# EAGLE design FluxamasynthPi (EAGLE 9.0.0)
ABBREV: Flux3; AUTHOR: Nadya B.; PROJECT: Fluxamasynth 3
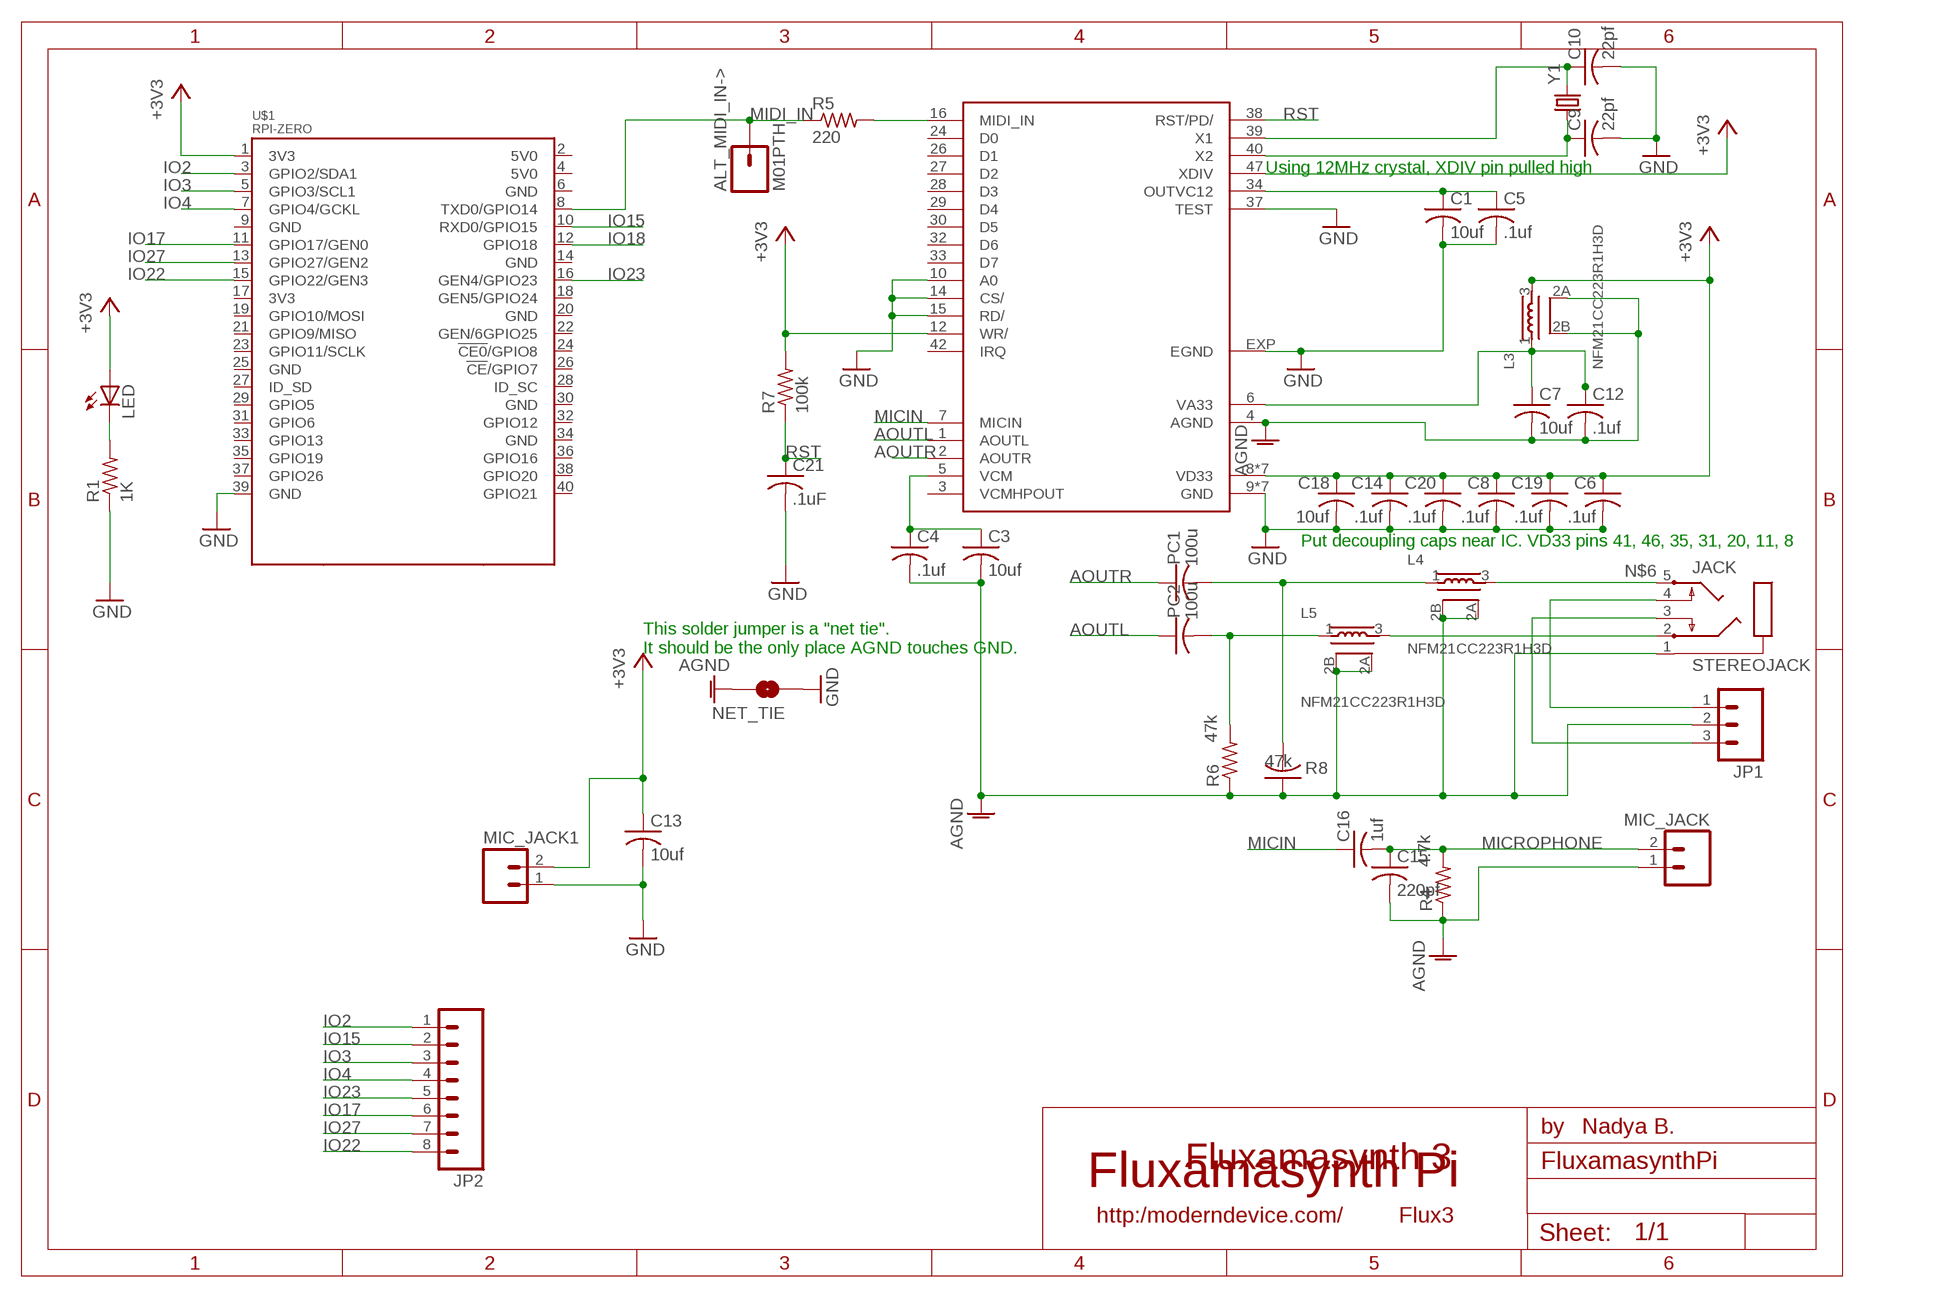
[diagram p0: schematic, sheet 1]

## Parts
ALT_MIDI_IN->  M01PTH  [1X01]
C1  10uf  C-USC0805K  [C0805K]
C3  10uf  C-USC0805K  [C0805K]
C4  .1uf  C-USC0603K  [C0603K]
C5  .1uf  C-USC0603K  [C0603K]
C6  .1uf  C-USC0603K  [C0603K]
C7  10uf  C-USC0805K  [C0805K]
C8  .1uf  C-USC0603K  [C0603K]
C9  22pf  C-USC0603  [C0603]
C10  22pf  C-USC0603  [C0603]
C12  .1uf  C-USC0603K  [C0603K]
C13  10uf  C-USC0805K  [C0805K]
C14  .1uf  C-USC0603K  [C0603K]
C15  220pf  C-USC0805K  [C0805K]
C16  1uf  C-USC0603K  [C0603K]
C18  10uf  C-USC0603K  [C0603K]
C19  .1uf  C-USC0603K  [C0603K]
C20  .1uf  C-USC0603K  [C0603K]
C21  .1uF  C-USC0603K  [C0603K]
JACK  STEREOJACK  [STX3100]
JP1  M03PTH  [1X03]
JP2  M08  [1X08]
L3  NFM21CC223R1H3D  [3PC]
L4  NFM21CC223R1H3D  [3PC]
L5  NFM21CC223R1H3D  [3PC]
LED  LED0603  [LED-0603]
MIC_JACK  M02PTH  [1X02]
MIC_JACK1  M02PTH  [1X02]
NET_TIE  MODERNDEVICE_SOLDERJUMPERTRACE  [MODERNDEVICE_SJ_2S-TRACE]
PC1  100u  C-USC1206K  [C1206K]
PC2  100u  C-USC1206K  [C1206K]
R1  1K  R-US_R0603  [R0603]
R4  4.7k  R-US_R0603  [R0603]
R5  220  R-US_R0603  [R0603]
R6  47k  R-US_R0603  [R0603]
R7  100k  R-US_R0603  [R0603]
R8  47k  C-USC0603K  [C0603K]
SAM2695  SAM2695  [QFN48]
U$1  RPI-ZERO  [RASPBERRYPI_BASTELSTUBE_V13_RASPI_BOARD_B+_FULL]
Y1  CRYSTALTXC-7A  [CRYSTAL-TXC-7A]

## Nets
+3V3 [VCC]: C6.1 C8.1 C13.1 C14.1 C18.1 C19.1 C20.1 L3.3 LED.A MIC_JACK1.2 R7.2 SAM2695.8(VD33) SAM2695.11(VD33) SAM2695.12(WR/) SAM2695.20(VD33) SAM2695.31(VD33) SAM2695.35(VD33) SAM2695.41(VD33) SAM2695.46(VD33) SAM2695.47(XDIV) U$1.1(3V3)
AGND [GND]: C3.2 C4.2 C7.2 C12.2 C15.2 JACK.1 JP1.2 L3.2A L3.2B L4.2A L4.2B L5.2A L5.2B MIC_JACK.1 NET_TIE.2 R4.1 R6.1 R8.1 SAM2695.4(AGND)
AOUTL: PC2.1 SAM2695.1(AOUTL)
AOUTR: PC1.1 SAM2695.2(AOUTR)
GND [GND]: C1.2 C5.2 C6.2 C8.2 C9.2 C10.2 C13.2 C14.2 C18.2 C19.2 C20.2 C21.2 MIC_JACK1.1 NET_TIE.1 R1.1 SAM2695.9(GND) SAM2695.10(A0) SAM2695.13(GND) SAM2695.14(CS/) SAM2695.15(RD/) SAM2695.18(GND) SAM2695.25(GND) SAM2695.36(GND) SAM2695.37(TEST) SAM2695.45(GND) SAM2695.48(GND) SAM2695.EXP(EGND) U$1.39(GND)
IO2: JP2.1 U$1.3(GPIO2/SDA1)
IO3: JP2.3 U$1.5(GPIO3/SCL1)
IO4: JP2.4 U$1.7(GPIO4/GCKL)
IO15: JP2.2 U$1.10(RXD0/GPIO15)
IO17: JP2.6 U$1.11(GPIO17/GEN0)
IO18: U$1.12(GPIO18)
IO22: JP2.8 U$1.15(GPIO22/GEN3)
IO23: JP2.5 U$1.16(GEN4/GPIO23)
IO27: JP2.7 U$1.13(GPIO27/GEN2)
MICIN: C16.1 SAM2695.7(MICIN)
MICROPHONE: C15.1 C16.2 MIC_JACK.2 R4.2
MIDI_IN: ALT_MIDI_IN->.1 R5.1 U$1.8(TXD0/GPIO14)
N$5: L5.1 PC2.2 R6.2
N$6: JACK.5 L4.3
N$9: LED.C R1.2
N$12: R5.2 SAM2695.16(MIDI_IN)
N$21: JACK.4 JP1.1
N$24: JACK.3 JP1.3
OUT_L: JACK.2 L5.3
OUT_R: L4.1 PC1.2 R8.2
OUTVC12: C1.1 C5.1 SAM2695.34(OUTVC12)
RST: C21.1 R7.1 SAM2695.38(RST/PD/)
VA33 [VCC]: C7.1 C12.1 L3.1 SAM2695.6(VA33)
VCM: C3.1 C4.1 SAM2695.5(VCM)
XTL1: C10.1 SAM2695.39(X1) Y1.P$2
XTL2: C9.1 SAM2695.40(X2) Y1.P$1
Unconnected: SAM2695.3(VCMHPOUT) SAM2695.24(D0) SAM2695.26(D1) SAM2695.27(D2) SAM2695.28(D3) SAM2695.29(D4) SAM2695.30(D5) SAM2695.32(D6) SAM2695.33(D7) SAM2695.42(IRQ) U$1.2(5V0) U$1.4(5V0) U$1.6(GND) U$1.9(GND) U$1.14(GND) U$1.17(3V3) U$1.18(GEN5/GPIO24) U$1.19(GPIO10/MOSI) U$1.20(GND) U$1.21(GPIO9/MISO) U$1.22(GEN/6GPIO25) U$1.23(GPIO11/SCLK) U$1.24(!CE0!/GPIO8) U$1.25(GND) U$1.26(!CE!/GPIO7) U$1.27(ID_SD) U$1.28(ID_SC) U$1.29(GPIO5) U$1.30(GND) U$1.31(GPIO6) U$1.32(GPIO12) U$1.33(GPIO13) U$1.34(GND) U$1.35(GPIO19) U$1.36(GPIO16) U$1.37(GPIO26) U$1.38(GPIO20) U$1.40(GPIO21)

## Notes on the sheet
- Using 12MHz crystal, XDIV pin pulled high
- Put decoupling caps near IC. VD33 pins 41, 46, 35, 31, 20, 11, 8
- This solder jumper is a "net tie".
  It should be the only place AGND touches GND.
- Fluxamasynth Pi

## Library data of the parts
ALT_MIDI_IN-> = ModernDevice:M01: Header 1 Standard 1-pin 0.1" header. Use with straight break away headers (SKU : PRT-00116), right angle break away headers (PRT-00553), swiss pins (PRT-00743), machine pins (PRT-00117), and female headers (PRT-00115).
C1 C3-C10 C12-C16 C18-C21 PC1 PC2 R8 = ModernDevice:C-US: CAPACITOR, American symbol
JACK = ModernDevice:STEREOJACK: MIC/HEADPHONE JACK Stereo jack with two switches. Kycon STX3100, CUI SJ1-3555NG and/or 4UCon 05544
JP1 = ModernDevice:M03: Header 3 Standard 3-pin 0.1" header. Use with straight break away headers (SKU : PRT-00116), right angle break away headers (PRT-00553), swiss pins (PRT-00743), machine pins (PRT-00117), and female headers (PRT-00115). Molex polarized connector foot print use with SKU : PRT-08232 with associated crimp pins and housings.
JP2 = ModernDevice:M08: Header 8 Standard 8-pin 0.1" header. Use with straight break away headers (SKU : PRT-00116), right angle break away headers (PRT-00553), swiss pins (PRT-00743), machine pins (PRT-00117), and female headers (PRT-00115).
L3-L5 = ModernDevice:NFM21CC223R1H3D: CAPACITOR-TYPE NOISE SUPPRESSION FILTER digikey #NFM21CC223R1H3D
LED = ModernDevice:LED: LEDs Standard schematic elements and footprints for 5mm, 3mm, 1206, and 0603 sized LEDs. 5mm - Spark Fun Electronics SKU : COM-00529 (and others)
MIC_JACK MIC_JACK1 = ModernDevice:M02: Header 2 Standard 2-pin 0.1" header. Use with straight break away headers (SKU : PRT-00116), right angle break away headers (PRT-00553), swiss pins (PRT-00743), machine pins (PRT-00117), and female headers (PRT-00115). Molex polarized connector foot print use with SKU : PRT-08233 with associated crimp pins and housings.
NET_TIE = BBLeo_v2:MODERNDEVICE_SOLDERJUMPER: Solder Jumper Standard SMD solder jumper. Used to automate production. Two varients : Normally Open and Normally Closed are the same, but have different paste layers. NC will have a large amount of paste and should jumper during reflow.
R1 R4-R7 = ModernDevice:R-US_: RESISTOR, American symbol
SAM2695 = ModernDevice:SAM2695
U$1 = RPI-Zero:RPI-ZERO
Y1 = SparkFun-FreqCtrl:CRYSTAL: Various standard crystals. Proven footprints. Spark Fun Electronics SKU : COM-00534

## Net classes
0 default: width 0.152 mm, drill 0.152 mm, clearance 0.152 mm
1 GND: width 0.152 mm, drill 0.152 mm, clearance 0.152 mm
2 VCC: width 0.152 mm, drill 0.152 mm, clearance 0.152 mm
3 VBUS: width 0.152 mm, drill 0.152 mm, clearance 0.152 mm

## Board
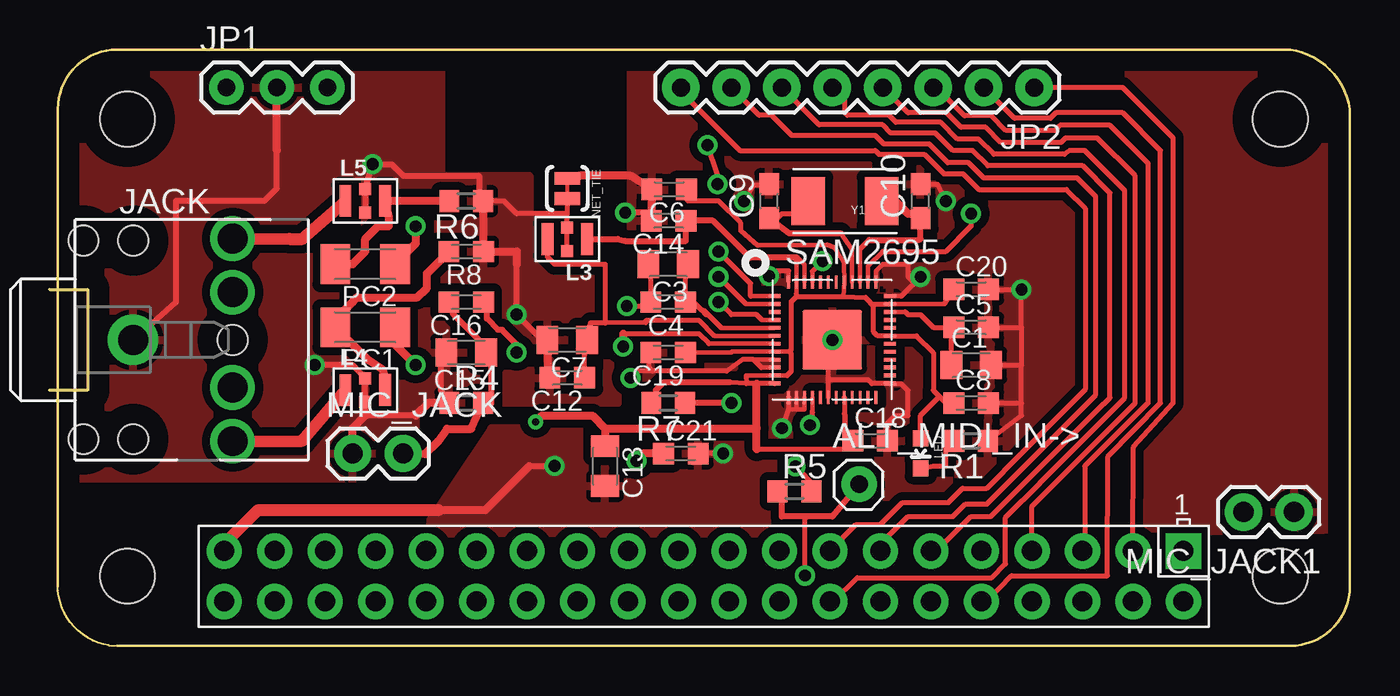
[diagram p1: board, top side]
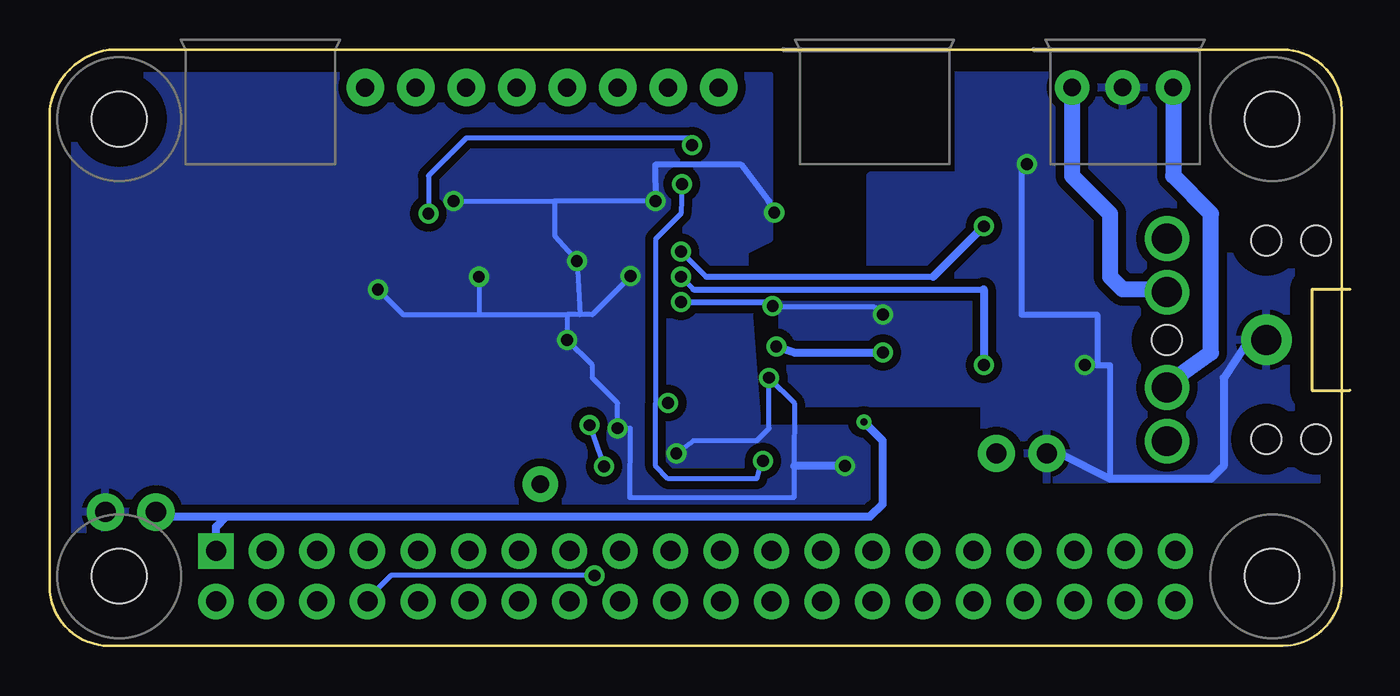
[diagram p2: board, bottom side, seen from below]

Size 65.41 x 30.01 mm. Coordinates in mm from the lower left corner, seen from the top.
Outline: 2.99,0.03 arc-81 0.4,3.08
Outline: 2.97,0.03 3.4,0
Outline: 0,17.94 1.91,17.94 1.91,12.86 0,12.86
Copper layers (1*16): Top 0.035mm / dielectric 1.5mm / Bottom 0.035mm
Design rules "default *": minimum track width 6mil, minimum drill 0.35mm, track to track 6mil, track to pad 6mil, pad to pad 6mil, via to via 6mil, smd to smd 6mil, copper to edge 40mil, drill to drill 6mil, minimum pad ring 10mil, minimum via ring 8mil, stop-mask expansion 4mil, vias tented up to drill 25mil, thermal gap 10mil

### Footprints (pad centres in the part's own frame; a part is rotated, then mirrored left to right if it is on the bottom)
1X01 = drill 0.889 pad 1.778: 1 0,0
C0805K = smd 1.1 x 1.4: 1 -1,0; 2 1,0
C0603K = smd 1.05 x 1.08: 1 -0.875,0; 2 0.875,0
C0603 = smd 1.1 x 1: 1 -0.85,0; 2 0.85,0
STX3100 = drill 1.5 pad 2.54: 1 2.929,0.002 | drill 1.5: 2 7.929,5.102; 3 7.929,2.402; 4 7.929,-2.398; 5 7.929,-5.098 | hole 1.5: 2.929,5.002; 2.929,-4.998; 7.929,0.002; 0.429,5.002; 0.429,-4.998
1X03 = drill 0.889 pad 1.727: 1 0,0; 2 2.54,0; 3 5.08,0
1X08 = drill 0.9 pad 1.88: 1 0,0; 2 2.54,0; 3 5.08,0; 4 7.62,0; 5 10.16,0; 6 12.7,0; 7 15.24,0; 8 17.78,0
3PC = smd 0.6 x 1.6: 1 0.998,0.013; 3 -1,0.01 | smd 0.6 x 0.6: 2A 0,-0.58; 2B 0,0.6
LED-0603 = smd 0.8 x 0.8: A 0,-0.75; C 0,0.75
1X02 = drill 1.016 pad 1.88: 1 0,0; 2 2.54,0
MODERNDEVICE_SJ_2S-TRACE = smd 0.635 x 1.27: 1 -0.508,0; 2 0.508,0
C1206K = smd 1.5 x 2: 1 -1.5,0; 2 1.5,0
R0603 = smd 1 x 1.1: 1 -0.85,0; 2 0.85,0
QFN48 = smd 0.65 x 0.2: 1 -2.9,2.206; 2 -2.9,1.806; 3 -2.9,1.406; 4 -2.9,1.006; 5 -2.9,0.606; 6 -2.9,0.206; 7 -2.9,-0.194; 8 -2.9,-0.594; 9 -2.9,-0.994; 10 -2.9,-1.394; 11 -2.9,-1.794; 12 -2.9,-2.194; 25 2.9,-2.194; 26 2.9,-1.794; 27 2.9,-1.394; 28 2.9,-0.994; 29 2.9,-0.594; 30 2.9,-0.194; 31 2.9,0.206; 32 2.9,0.606; 33 2.9,1.006; 34 2.9,1.406; 35 2.9,1.806; 36 2.9,2.206 | smd 0.2 x 0.65: 13 -2.2,-2.894; 14 -1.8,-2.894; 15 -1.4,-2.894; 16 -1,-2.894; 17 -0.6,-2.894; 18 -0.2,-2.894; 19 0.2,-2.894; 20 0.6,-2.894; 21 1,-2.894; 22 1.4,-2.894; 23 1.8,-2.894; 24 2.2,-2.894; 37 2.2,2.906; 38 1.8,2.906; 39 1.4,2.906; 40 1,2.906; 41 0.6,2.906; 42 0.2,2.906; 43 -0.2,2.906; 44 -0.6,2.906; 45 -1,2.906; 46 -1.4,2.906; 47 -1.8,2.906; 48 -2.2,2.906 | smd 3 x 3: EXP 0,0
RASPBERRYPI_BASTELSTUBE_V13_RASPI_BOARD_B+_FULL = drill 1 pad 1.778 square: 1 8.37,25.23 | drill 1 pad 1.778: 2 8.37,27.77; 3 10.91,25.23; 4 10.91,27.77; 5 13.45,25.23; 6 13.45,27.77; 7 15.99,25.23; 8 15.99,27.77; 9 18.53,25.23; 10 18.53,27.77; 11 21.07,25.23; 12 21.07,27.77; 13 23.61,25.23; 14 23.61,27.77; 15 26.15,25.23; 16 26.15,27.77; 17 28.69,25.23; 18 28.69,27.77; 19 31.23,25.23; 20 31.23,27.77; 21 33.77,25.23; 22 33.77,27.77; 23 36.31,25.23; 24 36.31,27.77; 25 38.85,25.23; 26 38.85,27.77; 27 41.39,25.23; 28 41.39,27.77; 29 43.93,25.23; 30 43.93,27.77; 31 46.47,25.23; 32 46.47,27.77; 33 49.01,25.23; 34 49.01,27.77; 35 51.55,25.23; 36 51.55,27.77; 37 54.09,25.23; 38 54.09,27.77; 39 56.63,25.23; 40 56.63,27.77 | hole 2.75: 3.5,3.5; 3.5,26.5; 61.5,3.5; 61.5,26.5
CRYSTAL-TXC-7A = smd 1.7 x 2.4: P$1 1.85,0; P$2 -1.85,0

### Placement (x,y rotation side)
ALT_MIDI_IN->  40.72,8.14 0 top
C1  46.36,14.13 0 top
C3  31.11,19.21 180 top
C4  31.11,17.31 180 top
C5  46.36,16.04 0 top
C6  31.17,22.97 180 top
C7  26.04,15.4 180 top
C8  46.36,12.23 0 top
C9  36.2,22.39 90 top
C10  43.82,22.39 90 top
C12  26.04,13.5 180 top
C13  27.94,9.05 270 top
C14  31.14,21.4 180 top
C15  20.95,14.77 180 top
C16  20.95,17.31 180 top
C18  41.28,10.32 0 top
C19  31.11,14.77 180 top
C20  46.36,17.94 0 top
C21  31.75,9.69 0 top
JACK  1.27,15.4 0 top
JP1  8.89,28.1 0 top
JP2  49.53,28.1 180 top
L3  26.04,20.48 180 top
L4  15.88,12.86 0 top
L5  15.88,22.39 0 top
LED  43.82,9.69 180 top
MIC_JACK  15.24,9.69 0 top
MIC_JACK1  62.6,6.74 180 top
NET_TIE  26.04,23.02 270 top
PC1  15.88,16.04 180 top
PC2  15.88,19.21 180 top
R1  46.36,10.32 180 top
R4  20.95,12.23 0 top
R5  37.47,7.78 0 top
R6  20.95,22.39 180 top
R7  31.11,12.23 180 top
R8  20.95,19.85 180 top
SAM2695  39.37,15.4 0 top
U$1  65.41,30.01 180 top
Y1  40.01,22.39 180 top

### Tracks (layer width: path | path; a pad name or v marks a point on that pad's centre or on a via)
+3V3  (via drill 0.35)
  Top 0.229: SAM2695.35 44.99,17.21 | 37.57,17.72 SAM2695.47 37.57,19.44 | 39.93,17.59 SAM2695.41 39.95,19.21 39.95,19.27 39.6,19.87 | 35.04,13.61 SAM2695.11 37.09,13.61 | C19.1 34.29,14.77 34.33,14.81 SAM2695.8 37.11,14.81 37.12,14.82 37.21,14.82 | SAM2695.46 37.97,19.19 37.62,19.54
  Top 0.254: 44.99,17.21 45.09,17.31 C20.1 | 44.77,12.55 44.45,12.86 44.45,14.77 43.61,15.61 SAM2695.31 41.65,15.61 41.45,15.81 41.45,17.11 41.35,17.21 | 44.77,12.55 45.09,12.23 C8.1 | 41.35,17.21 41.28,17.28 41.28,17.31 41.05,17.54 39.93,17.59 37.57,17.59 | 41.35,17.21 SAM2695.35 | 37.57,17.72 37.57,17.59 | LED.A 43.82,11.59 44.77,12.55 | C18.1 40.01,10.72 40.01,11.59 39.98,11.7 SAM2695.20 39.97,10.36 40.01,9.89 35.56,9.89 | 35.04,13.61 35.04,13.21 | 35.04,13.21 34.21,13.27 | SAM2695.12 35.56,13.21 35.04,13.21 | 37.09,13.61 37.31,13.83 37.31,14.72 37.21,14.82 37.24,14.82 37.31,14.9 37.31,17.33 37.57,17.59 | 39.6,19.87 39.47,20.05 39.12,20.18 35.61,20.15 34.77,20.89 34.77,21.27 33.66,22.39 32.09,22.39 C6.1 | 37.57,19.44 37.47,19.54
  Top 0.305: 37.62,19.54 37.47,19.54 35.23,19.54 33.38,21.4 C14.1 32,20.38 28.96,20.38 28.57,20.48 27.3,20.48 L3.3 | 34.21,13.27 30.89,13.27 30.48,12.86 30.48,12.44 R7.2
  Top 0.406: 35.56,9.89 35.56,10.96 | 35.56,10.96 35.56,13.21 | 27.94,10.96 35.56,10.96 | v24.45,11.28 24.77,11.59 27.3,11.59 27.94,10.96 | 27.94,10.96 C13.1
  Bottom 0.406: U$1.1 57.04,5.99 56.52,6.51 | 56.52,6.51 24.13,6.51 23.5,7.15 23.5,10.32 v24.45,11.28 | MIC_JACK1.2 59.83,6.51 56.52,6.51
AGND  (via drill 0.6)
  Top 0.229: SAM2695.4 35.82,16.41
  Top 0.254: 35.82,16.41 35.56,16.67 34.29,16.67 v33.66,17.31 | C3.2 30.24,19.09 C4.2 30.04,17.11 v29.03,17.11 | L3.2B L3.2A 26.04,21.75 | NET_TIE.2 26.04,21.75 | 26.04,21.75 23.5,21.75 22.86,22.39 R6.1
  Top 0.305: v13.33,14.13 15.24,14.13 L4.2B L4.2A 15.88,11.59 18.41,11.59 | L5.2A L5.2B v16.26,24.24 17.2,24.24 17.78,23.66 21.59,23.66 21.59,22.6 R6.1 | 23.5,19.21 v23.5,16.67 24.77,15.4 24.77,15.04 C7.2 | JACK.1 6.35,17.31 6.35,22.39 10.79,22.39 11.43,23.02 11.43,24.93 | R4.1 19.68,12.86 19.68,14.13 C15.2
  Top 0.406: C7.2 25.04,13.62 C12.2 | 23.5,19.21 23.5,19.85 R8.1 21.83,22.36 R6.1 | R4.1 19.05,12.23 18.41,11.59 | MIC_JACK.1 15.24,10.96 15.88,11.59 | 11.43,24.93 JP1.2
  Bottom 0.254: 29.21,17.31 29.21,17.28 | v23.5,16.67 23.55,16.67 23.93,17.06 28.98,17.06
  Bottom 0.305: v13.33,14.13 12.7,14.13 | 12.7,14.13 12.06,14.13 12.06,8.42 | 12.7,14.13 12.7,16.67 16.51,16.67 16.51,23.99 v16.26,24.24 | v33.66,17.31 29.21,17.31 | 29.21,17.28 v29.03,17.11 28.98,17.06
  Bottom 0.406: JACK.1 5.08,15.41 6.35,13.5 6.35,9.05 6.98,8.42 12.06,8.42 14.61,9.69 MIC_JACK.1
  pour Top (isolate 0.406): -1.27,8.42 -0.64,31.28 19.68,31.28 19.68,23.66 24.13,23.66 24.13,19.21 28.57,19.21 28.57,12.23 18.41,12.23 18.41,8.42
  pour Bottom (isolate 0.406): -1.27,8.42 -1.9,30.01 19.68,30.01 19.68,23.66 24.13,23.66 24.13,19.21 28.57,19.21 28.57,12.23 18.41,12.23 18.41,8.42
AOUTL  (via drill 0.6)
  Top 0.229: SAM2695.1 35.26,17.61
  Top 0.254: 35.26,17.61 35.26,18.25 v33.66,19.85
  Top 0.406: v18.41,21.12 18.41,20.25 PC2.1
  Bottom 0.254: v33.66,19.85 32.38,18.58
  Bottom 0.305: 32.38,18.58 20.95,18.58
  Bottom 0.406: 20.95,18.58 v18.41,21.12
AOUTR  (via drill 0.6)
  Top 0.229: SAM2695.2 35.02,17.21
  Top 0.254: 35.02,17.21 v33.66,18.58
  Top 0.406: v18.41,14.13 17.14,15.4 17.14,15.81 PC1.1
  Bottom 0.254: v33.66,18.58 33.02,17.94
  Bottom 0.305: 33.02,17.94 18.41,17.94
  Bottom 0.406: 18.41,17.94 v18.41,14.13
GND  (via drill 0.6)
  Top 0.229: SAM2695.36 42.85,17.61 | SAM2695.37 41.57,18.87 41.91,19.21 | 37.16,11.9 37.57,11.9 | 37.57,11.9 37.97,11.9 SAM2695.15 | SAM2695.14 37.57,11.9 | SAM2695.9 35.41,14.41 | SAM2695.10 35.81,14.01 | SAM2695.45 38.37,18.85 | SAM2695.48 37.17,18.87 | SAM2695.13 37.17,11.93
  Top 0.254: C1.2 48.9,14.13 | C20.2 v48.9,17.94 48.9,16.04 | 48.9,16.04 48.9,14.13 | C8.2 48.9,12.23 | 48.9,12.23 48.9,14.13 | 42.85,17.61 43.5,18.26 | 41.91,19.21 43.18,19.21 43.18,18.58 43.5,18.26 | SAM2695.13 37.16,11.9 | 30.33,13.83 34.06,13.83 34.85,14.41 35.41,14.41 35.81,14.01 | 30.33,13.83 30.15,14.03 30.15,14.68 C19.2 | SAM2695.18 39.17,13.5 | 39.17,13.5 39.17,15.2 | 39.17,13.5 39.27,13.4 41.17,13.4 41.36,13.21 SAM2695.25 42.83,13.21 43.18,12.86 43.18,11.59 42.55,11.59 42.15,11.2 C18.2 | 37.17,18.87 36.44,18.87 v36.19,18.62 | 38.37,18.85 v38.89,19.37 | 36.2,23.19 35.4,23.19 v34.93,22.39 | C10.2 44.67,23.24 v45.09,22.39 | 43.5,18.26 v43.82,18.58 | R1.1 48.9,11.59 48.9,12.23 | C5.2 48.9,16.04 | 37.17,11.93 v36.83,10.96 | 30.33,13.83 29.54,13.83 v29.21,13.5 | v33.88,9.69 C21.2
  Top 0.305: C14.2 30.29,21.81 v28.96,21.81 | 24.13,9.05 v25.4,9.05
  Top 0.406: 36.2,23.19 C9.2 | 32.38,9.29 C21.2 | 30.29,21.81 C6.2 29.21,23.66 26.67,23.66 NET_TIE.1 | 19.54,6.84 21.92,6.84 24.13,9.05
  Top 0.61: 19.54,6.84 10.49,6.84 8.89,5.24 8.89,4.89 U$1.39
  Bottom 0.254: v48.9,17.94 47.62,16.67 43.82,16.67 | 43.82,16.67 39.37,16.67 | 39.37,16.67 SAM2695.EXP 38.1,14.13 38.1,13.5 36.83,12.23 v36.83,10.96 36.2,10.96 36.22,7.45 27.96,7.45 27.96,9.06 27.94,12.23 v29.21,13.5 29.21,10.96 29.84,10.32 33.02,10.32 v33.88,9.69 | v36.19,18.62 36.24,18.62 36.2,18.58 38.1,16.67 38.74,16.67 | 38.74,16.67 39.37,16.67 | 38.74,16.67 v38.89,19.37 40.01,20.64 40.01,22.39 | v45.09,22.39 40.01,22.39 | v34.93,22.39 40.01,22.39 | v43.82,18.58 43.82,16.67
  Bottom 0.305: v28.96,21.81 29.21,22.39 30.61,24.22 34.95,24.22 v34.93,22.39
  Bottom 0.406: v25.4,9.05 27.95,9.05 27.96,9.06
  other vias: 39.37,15.4
  pour Bottom (isolate 0.406): 29.21,28.74 29.21,20.48 30.48,19.85 29.84,11.59 29.84,10.96 22.22,10.96 19.05,5.88 66.04,5.88 66.04,28.74
  pour Top (isolate 0.406): 29.21,33.82 29.21,20.48 30.48,19.85 29.84,11.59 29.84,10.96 22.22,10.96 18.41,5.24 66.04,5.88 66.04,33.82
IO2
  Top 0.254: U$1.3 54.52,10.01 56.52,12.23 56.52,25.56 53.98,28.1 JP2.1
IO3
  Top 0.254: 52.07,4.89 52.07,9.05 55.25,12.23 55.25,24.29 53.34,26.2 50.83,26.2 50.57,25.95 48.11,25.95 47.37,26.68 46.03,26.68 44.98,27.72 44.83,27.72 JP2.3
  Top 0.305: 52.07,4.89 U$1.5
IO4
  Top 0.254: U$1.7 49.42,7.03 54.61,12.23 54.61,23.66 52.71,25.56 51.11,25.56 50.88,25.34 47.85,25.34 47.09,26.1 45.85,26.1 45.11,26.83 43.18,26.83 JP2.4
IO15
  Top 0.254: 47.16,2.24 48.39,3.54 53.21,3.54 53.24,9.54 55.88,12.23 55.88,24.93 53.98,26.83 50.62,26.83 50.34,26.56 48.54,26.56 JP2.2
  Top 0.305: U$1.10 47.16,2.24
IO17
  Top 0.254: U$1.11 44.62,4.78 46.36,6.51 47.35,6.51 53.04,12.2 53.06,12.2 53.34,12.48 53.34,22.8 51.97,24.17 47.19,24.17 46.43,24.93 45.44,24.93 44.55,25.82 42.32,25.82 41.91,26.22 38.71,26.22 JP2.6
IO22
  Top 0.254: U$1.15 39.26,4.8 40.56,6.11 41.78,6.11 42.9,7.23 45.21,7.23 45.92,7.94 47.14,7.94 48.9,9.69 52.05,12.86 52.1,12.92 52.1,22.03 51.16,22.97 46.74,22.97 45.95,23.76 44.98,23.76 43.99,24.75 41.71,24.75 41.53,24.93 34.72,24.93 32.18,27.47 JP2.8
IO23
  Top 0.254: U$1.16 39.41,2.24 40.62,3.44 47.4,3.44 48.08,4.13 48.08,6.46 49.84,8.22 49.84,8.24 54.08,12.48 54.08,22.92 52.07,24.93 51.31,24.93 51.05,24.75 47.5,24.75 46.71,25.51 45.67,25.51 44.83,26.35 42.57,26.35 42.22,26.71 40.13,26.71 40.01,26.83 40.01,27.47 JP2.5
IO27
  Top 0.254: U$1.13 41.8,5.13 43.18,6.51 45.44,6.51 46.08,7.15 47.17,7.15 47.17,7.17 52.63,12.64 52.63,22.62 51.69,23.56 46.99,23.56 46.23,24.32 45.19,24.32 44.25,25.26 41.96,25.26 41.53,25.69 37.34,25.69 36.32,26.71 35.69,26.71 JP2.7
MICIN  (via drill 0.6)
  Top 0.229: SAM2695.7 33.16,15.21
  Top 0.254: 33.16,15.21 32.66,15.71 28.85,15.71
  Top 0.305: v23.5,14.77 23.5,15.18 22.76,15.91 22.55,15.91 22,16.47 22,17.14 C16.1
  Top 0.406: 28.85,15.71 v28.85,15.07 | 21.59,17.07 C16.1
  Bottom 0.406: v28.85,15.07 27.91,14.77 v23.5,14.77
MICROPHONE
  Top 0.305: R4.2 22.22,12.23 22.22,14.13 C15.1 21.59,15.4 20.32,16.67 C16.2
  Top 0.406: MIC_JACK.2 18.9,9.66 19.53,10.3 19.99,10.93 21.21,10.93 R4.2
MIDI_IN  (via drill 0.6)
  Top 0.254: v38,3.54 38,6.41 38.1,6.51
  Top 0.305: ALT_MIDI_IN->.1 39.37,6.51 38.1,6.51 36.83,6.51 36.83,7.57 R5.1
  Bottom 0.254: U$1.8 49.42,2.36 48.21,3.57 38.02,3.57 v38,3.54
N$5
  Top 0.406: PC2.2 15.24,19.21 15.88,19.85 15.88,20.48 16.51,21.12 17.04,21.12 17.07,21.14 17.07,21.57 L5.1 16.89,22.39 R6.2
N$6
  Top 0.61: JACK.5 12.7,10.32 L4.3
N$9
  Top 0.254: LED.C 44.45,9.05 45.09,9.05 45.09,10.32 R1.2
N$12  (via drill 0.6)
  Top 0.229: SAM2695.16 38.37,11.81
  Top 0.254: 38.37,11.81 v38.25,11.11 | v37.52,9.03 38.53,8 R5.2
  Bottom 0.254: v38.25,11.11 v37.52,9.03
N$21
  Bottom 0.406: JACK.4 9.2,13.19
  Bottom 0.813: 9.2,13.19 6.98,14.77 6.98,21.75 8.89,23.66 JP1.1
N$24
  Bottom 0.61: JACK.3 9.53,17.94
  Bottom 0.813: 9.53,17.94 11.43,17.94 12.06,18.58 12.06,21.75 13.97,23.66 JP1.3
OUT_L
  Top 0.61: JACK.2 12.06,20.48 12.7,20.48 L5.3
OUT_R
  Top 0.406: L4.1 16.87,13.49 16.76,13.88 16.03,14.39 PC1.2 14.61,16.04 14.61,16.67 15.24,17.31 15.24,17.33 15.44,17.54 18.49,17.54 18.97,18.02 18.97,18.74 R8.2
OUTVC12
  Top 0.229: SAM2695.34 43.04,16.81
  Top 0.254: 43.04,16.81 43.18,16.67 43.82,16.67 44.45,16.04 C5.1 45.36,15.91 C1.1
RST  (via drill 0.6)
  Top 0.229: SAM2695.38 41.17,19.11 41.91,19.85
  Top 0.254: 41.91,19.85 45.09,19.85 46.36,21.12 v46.36,21.75 | 29.84,9.69 29.84,9.64 v29.52,9.31 | v33.6,23.25 33.6,23.71 v33.1,25.21
  Top 0.305: v34.29,12.23 R7.1
  Top 0.406: C21.1 29.84,9.69
  Bottom 0.254: v33.6,23.25 33.66,21.75 34.93,20.48 34.93,12.23 | 34.93,12.23 v34.29,12.23 | v29.52,9.31 29.59,9.31 29.84,8.42 34.29,8.42 34.93,9.05 34.93,12.23 | v33.1,25.21 33.02,25.56 44.45,25.56 46.36,23.66 v46.36,21.75
VA33
  Top 0.229: SAM2695.6 33.45,15.61
  Top 0.254: 33.45,15.61 32.69,16.37 30,16.37 30,16.27 27.94,16.24 | 27.94,16.24 27.22,16.24 | C12.1 26.91,14.64 C7.1 | L3.1 25.04,19.58 25.4,19.21 27.94,19.21 27.94,16.24
  Top 0.305: 27.22,16.24 27.05,15.91 C7.1
VCM
  Top 0.229: SAM2695.5 33.79,16.01
  Top 0.254: 33.79,16.01 32.92,16.88 | 32.92,16.88 32.82,16.88 32.38,17.31 C4.1 31.99,19.09 C3.1 | 32.92,16.88 32.92,16.78 33.02,16.67
XTL1
  Top 0.229: SAM2695.39 40.77,19.98
  Top 0.254: 40.77,19.98 41.22,20.43
  Top 0.305: 41.22,20.43 43.69,20.43 43.82,20.48 C10.1
  Top 0.406: Y1.P$2 42.55,22.39 43.18,21.75 43.6,21.75 C10.1
XTL2
  Top 0.229: SAM2695.40 40.36,19.98
  Top 0.254: 40.36,19.98 39.8,20.76 | C9.1 36.62,21.54 36.83,21.75 37.89,21.75 38.24,21.4
  Top 0.305: C9.1 37.21,20.76 39.8,20.76
  Top 0.406: Y1.P$1 37.89,22.39 37.89,21.75